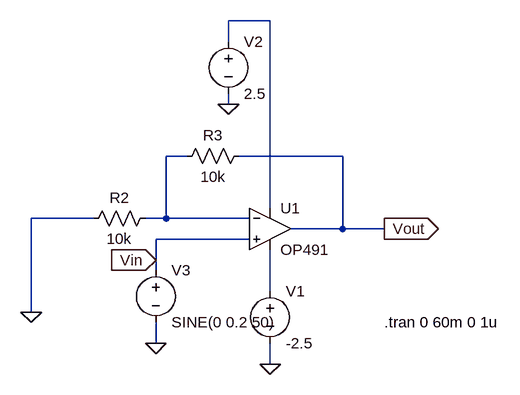
[diagram p0: schematic 002-non-inverting-amplifier.asc]
002-non-inverting-amplifier.asc, the LTspice schematic file:
Version 4
SHEET 1 880 680
WIRE 272 -176 208 -176
WIRE 208 -144 208 -176
WIRE 208 -48 208 -64
WIRE 144 32 112 32
WIRE 384 32 224 32
WIRE 272 112 272 -176
WIRE 0 128 -96 128
WIRE 112 128 112 32
WIRE 112 128 80 128
WIRE 240 128 112 128
WIRE 384 144 384 32
WIRE 384 144 304 144
WIRE 448 144 384 144
WIRE 240 160 96 160
WIRE 96 192 96 160
WIRE 96 208 96 192
WIRE 272 240 272 176
WIRE -96 272 -96 128
WIRE 96 320 96 288
WIRE 272 352 272 320
FLAG 272 352 0
FLAG 208 -48 0
FLAG -96 272 0
FLAG 96 192 Vin
IOPIN 96 192 In
FLAG 448 144 Vout
IOPIN 448 144 Out
FLAG 96 320 0
SYMBOL Opamps\\OP491 272 80 R0
SYMATTR InstName U1
SYMBOL voltage 272 224 R0
SYMATTR InstName V1
SYMATTR Value -2.5
SYMBOL voltage 208 -160 R0
SYMATTR InstName V2
SYMATTR Value 2.5
SYMBOL res 96 112 R90
WINDOW 0 0 56 VBottom 2
WINDOW 3 32 56 VTop 2
SYMATTR InstName R2
SYMATTR Value 10k
SYMBOL res 240 16 R90
WINDOW 0 0 56 VBottom 2
WINDOW 3 32 56 VTop 2
SYMATTR InstName R3
SYMATTR Value 10k
SYMBOL voltage 96 192 R0
WINDOW 123 0 0 Left 2
WINDOW 39 0 0 Left 2
SYMATTR InstName V3
SYMATTR Value SINE(0 0.2 50)
TEXT 448 288 Left 2 !.tran 0 60m 0 1u

The netlist it stands for:
* 002-non-inverting-amplifier.asc
XU1 Vin N002 N001 N003 Vout OP491  ; pins In+ In- V+ V- OUT
V1 N003 0 -2.5
V2 N001 0 2.5
R2 N002 0 10k
R3 Vout N002 10k
V3 Vin 0 SINE(0 0.2 50)
.tran 0 60m 0 1u
.backanno
.end